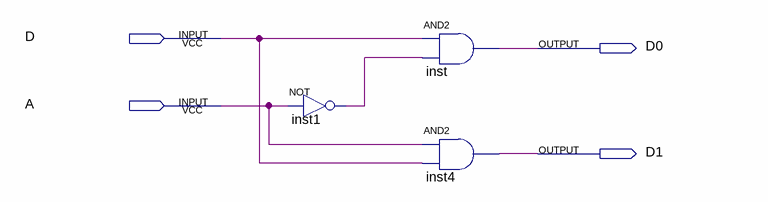
[diagram p0: schematic sheet]
// Quartus schematic dmx1x2.bdf as structural Verilog: 3 symbols, 4 pins
module dmx1x2 (
  input  D,
  input  A,
  output D0,
  output D1
);

  wire inst1_out;

  not inst1 (inst1_out, A);
  and inst (D0, D, inst1_out);
  and inst4 (D1, A, D);
endmodule
